# Altium schematic sheet Pg4 Switches, Latches, Connectors.SchDoc: Switches and Safety Latches
size Letter; Organization: Altium Limited; Address1: L3, 12a Rodborough Rd; Address2: Frenchs Forest; Address3: NSW; Address4: Australia 2086; SheetNumber: 4; SheetTotal: 4
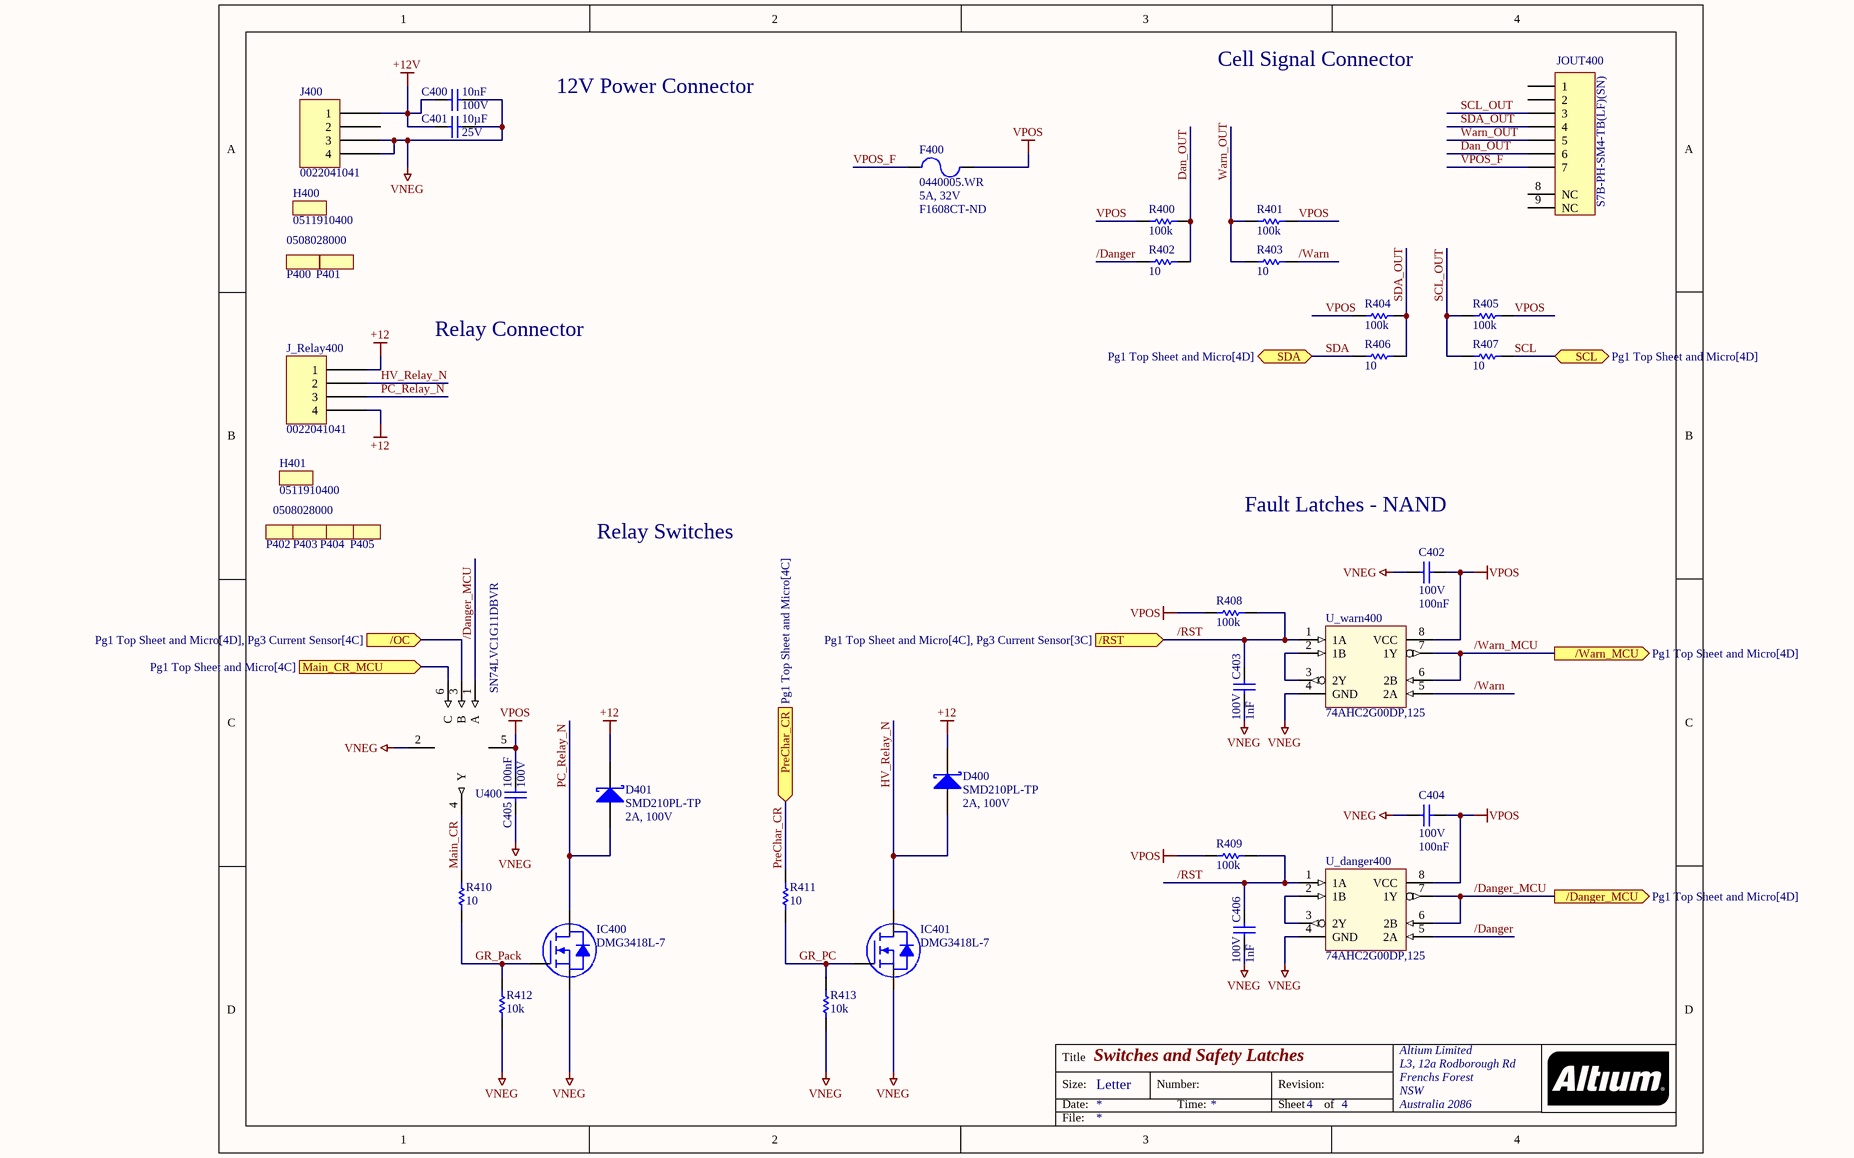
[diagram p0: Pg4 Switches, Latches, Connectors.SchDoc]

## Parts
C400  value 10nF  Rated: 100V  [CAPC2012N]  (hidden comment: C0805C103K1RAC7025)
C401  value 10µF  Rated: 25V  [CAPC3225N]  (hidden comment: C1210C106K3RACAUTO)
C402  value 100nF  Rated: 100V  [CAPC2012N]  (hidden comment: CL21B104KACNNNC)
C403  value 1nF  Rated: 100V  [CAPC2012N]  (hidden comment: C0805C102K1RACAUTO)
C404  value 100nF  Rated: 100V  [CAPC2012N]  (hidden comment: CL21B104KACNNNC)
C405  value 100nF  Rated: 100V  [CAPC2012N]  (hidden comment: CL21B104KACNNNC)
C406  value 1nF  Rated: 100V  [CAPC2012N]  (hidden comment: C0805C102K1RACAUTO)
D400  SMD210PL-TP  Rated: 2A, 100V  [SOD123]
D401  SMD210PL-TP  Rated: 2A, 100V  [SOD123]
F400  0440005.WR  Rated: 5A, 32V  Supplier Part Number 1: F1608CT-ND  [CAPC1608N]
H400  0511910400  (mechanical)
H401  0511910400  (mechanical)
IC400  DMG3418L-7  [DIODES SOT-23-3]
IC401  DMG3418L-7  [DIODES SOT-23-3]
J400  0022041041  [0022041041]
J_Relay400  0022041041  [0022041041]
JOUT400  S7B-PH-SM4-TB(LF)(SN)  [JST-PH-S7]
P400  0508028000  (value not drawn)  (mechanical)
P401  0508028000  (mechanical)
P402  0508028000  (value not drawn)  (mechanical)
P403  0508028000  (value not drawn)  (mechanical)
P404  0508028000  (value not drawn)  (mechanical)
P405  0508028000  (mechanical)
R400  value 100k  [RESC2012N]  (hidden comment: ERJ-6ENF1003V)
R401  value 100k  [RESC2012N]  (hidden comment: ERJ-6ENF1003V)
R402  value 10  [RESC2012N]  (hidden comment: ERJ-6ENF10R0V)
R403  value 10  [RESC2012N]  (hidden comment: ERJ-6ENF10R0V)
R404  value 100k  [RESC2012N]  (hidden comment: ERJ-6ENF1003V)
R405  value 100k  [RESC2012N]  (hidden comment: ERJ-6ENF1003V)
R406  value 10  [RESC2012N]  (hidden comment: ERJ-6ENF10R0V)
R407  value 10  [RESC2012N]  (hidden comment: ERJ-6ENF10R0V)
R408  value 100k  [RESC2012N]  (hidden comment: ERJ-6ENF1003V)
R409  value 100k  [RESC2012N]  (hidden comment: ERJ-6ENF1003V)
R410  value 10  [RESC2012N]  (hidden comment: ERJ-6ENF10R0V)
R411  value 10  [RESC2012N]  (hidden comment: ERJ-6ENF10R0V)
R412  value 10k  [RESC2012N]  (hidden comment: ERJ-6ENF1002V)
R413  value 10k  [RESC2012N]  (hidden comment: ERJ-6ENF1002V)
U400  SN74LVC1G11DBVR  [SOT23-6N]
U_danger400  74AHC2G00DP,125  [TSSOP-8]
U_warn400  74AHC2G00DP,125  [TSSOP-8]

## Ports
/Danger_MCU (out, see Pg1 Top Sheet and Micro[4D]), /OC (in, see Pg1 Top Sheet and Micro[4D], Pg3 Current Sensor[4C]), /RST (in, see Pg1 Top Sheet and Micro[4C], Pg3 Current Sensor[3C]), /Warn_MCU (out, see Pg1 Top Sheet and Micro[4D]), Main_CR_MCU (in, see Pg1 Top Sheet and Micro[4C]), PreChar_CR (in, see Pg1 Top Sheet and Micro[4C]), SCL (bidir, see Pg1 Top Sheet and Micro[4D]), SDA (bidir, see Pg1 Top Sheet and Micro[4D])

## Nets
+12: D400.2(K) D401.2(K) J_Relay400.1 J_Relay400.4
+12V: C400.1 C401.1 J400.1
VNEG: C400.2 C401.2 C402.2 C403.2 C404.2 C405.2 C406.2 IC400.2(S) IC401.2(S) J400.3 J400.4 R412.1 R413.1 U400.2(GND) U_danger400.4(GND) U_warn400.4(GND)
VPOS: C402.1 C404.1 C405.1 F400.2 R400.2 R401.1 R404.2 R405.1 R408.2 R409.2 U400.5(VCC) U_danger400.8(VCC) U_warn400.8(VCC)
/Danger: R402.1 U_danger400.5(2A)
/Danger_MCU: U400.1(A) U_danger400.6(2B) U_danger400.7(1Y) ; port /Danger_MCU
/OC: U400.3(B) ; port /OC
/RST: C403.1 C406.1 R408.1 R409.1 U_danger400.1(1A) U_warn400.1(1A) ; port /RST
/Warn: R403.2 U_warn400.5(2A)
/Warn_MCU: U_warn400.6(2B) U_warn400.7(1Y) ; port /Warn_MCU
Dan_OUT: JOUT400.6 R400.1 R402.2
GR_Pack: IC400.1(G) R410.1 R412.2
GR_PC: IC401.1(G) R411.1 R413.2
HV_Relay_N: D400.1(A) IC401.3(D) J_Relay400.2
Main_CR: R410.2 U400.4(Y)
Main_CR_MCU: U400.6(C) ; port Main_CR_MCU
PC_Relay_N: D401.1(A) IC400.3(D) J_Relay400.3
PreChar_CR: R411.2 ; port PreChar_CR
SCL: R407.2 ; port SCL
SCL_OUT: JOUT400.3 R405.2 R407.1
SDA: R406.1 ; port SDA
SDA_OUT: JOUT400.4 R404.1 R406.2
VPOS_F: F400.1 JOUT400.7
Warn_OUT: JOUT400.5 R401.2 R403.1
NetU_danger400_2: U_danger400.2(1B) U_danger400.3(2Y)
NetU_warn400_2: U_warn400.2(1B) U_warn400.3(2Y)

Not connected (* = marked no-connect by the designer): J400 2; JOUT400 1 2 8(NC) 9(NC)

## Notes on the sheet
- 12V Power Connector
- Cell Signal Connector
- Relay Connector
- Relay Switches
- Fault Latches - NAND
- Title
- Size:
- Date:
- Letter
- Number:
- Time:
- Revision:
- Sheet
- of
- File:

## Library data of the parts
C400 = C0805C103K1RAC7025: Capacitor, Ceramic, 10nF, 100V, 0805, 10%, 125C; Supplier 1: Digi-Key; Supplier Part Number 1: 399-C0805C103K1RAC7025CT-ND; Category: C; Tol: 10%; Temp: 125C
C401 = C1210C106K3RACAUTO: Capacitor, Ceramic, 10µF, 25V, 0805, 10%, 125C; Supplier 1: Digi-Key; Supplier Part Number 1: 399-7046-1-ND; Category: C; Tol: 10%; Temp: 125C
C402 C404 C405 = C0805C104K1RACAUTO: Capacitor, Ceramic, 100nF, 25V, 0805, 10%, 125C; Category: C; Tol: 10%; Temp: 125C; Supplier 1: Digi-Key; Supplier Part Number 1: 1276-1099-1-ND
C403 C406 = C0805C102K1RACAUTO: Capacitor, Ceramic, 1nF, 100V, 0805, 10%, 125C; Supplier 1: Digi-Key; Supplier Part Number 1: 399-6919-1-ND; Category: C; Tol: 10%; Temp: 125C
D400 D401 = SMD210PL: Diode, Si Sch, 100V, 2A, SOD123; Temp: 125C; Value: 850mV @ 2A; Category: D; Supplier 1: Digi-Key; Supplier Part Number 1: SMD210PL-TPMSCT-ND
F400 = 0440005.WR: Fuse, SMT, 5A, 32VAC/VDC, 1206; Value: 12mOhm; Temp: 150C; Category: F; Supplier 1: Digi-Key
H400 H401 = 0022041041(Housing): Housing, Molex, Maiting Part 0511910400; Value: 4 Pos; Category: J; Supplier 1: Digi-Key; Supplier Part Number 1: WM3350-ND
IC400 IC401 = DMG3418L-7: MOSFET N-CH 30V 4A SOT23; Manufacturer: Diodes Incorporated; Current - Continuous Drain (Id) @ 25°C: 4A (Ta); Drive Voltage (Max Rds On,  Min Rds On): 2.5V, 10V; FET Type: N-Channel; Gate Charge (Qg) (Max) @ Vgs: 5.5 nC @ 4.5 V; Input Capacitance (Ciss) (Max) @ Vds: 464.3 pF @ 15 V; Power Dissipation (Max): 1.4W (Ta); Rds On (Max) @ Id, Vgs: 60mOhm @ 4A, 10V; Vgs (Max): ±12V; Vgs(th) (Max) @ Id: 1.5V @ 250µA; Part Number: DMG3418L-7; ComponentLink1Description: Datasheet; ComponentLink1URL: https://www.diodes.com/assets/Datasheets/DMG3418L.pdf; ComponentLink2Description: DigiKey Link; ComponentLink2URL: https://www.digikey.com/en/products/detail/diodes-incorporated/DMG3418L-7/4810932; Drain to Source Voltage (Vdss): 30 V; LastUpdated: 2/2/2023 9:00:08 PM; Lifecycle Status: Active; Minimum Order: 1; Mounting Type: Surface Mount; Operating Temperature: -55°C ~ 150°C (TJ); Package / Case: TO-236-3, SC-59, SOT-23-3; Packaging: TapeAndReel; Part Status: Active; Price: 0.10; Series: -; Supplier 1: DigiKey; Supplier Part Number 1: DMG3418L-7DICT-ND; Supplier Device Package: SOT-23-3; Technology: MOSFET (Metal Oxide)
J400 J_Relay400 = 0022041041: Header, 4 pos, 2.5mm pitch, Molex / Kit Parts / Housing: 0511910400 / Terminals: 0508028000; Value: 4 Pos; Temp: 80C; Rated: N/A; Category: J; Tol: N/A; Supplier 1: Digi-Key; Supplier Part Number 1: WM18787-ND
JOUT400 = S7B-PH-SM4-TB(LF)(SN): Header, JST, 7-Pin, Right-Angle, PH, Surface Mount; Category: J; Supplier 1: Digi-Key; Supplier Part Number 1: 455-1754-1-ND
P400-P405 = 0022041041(Terminal): Terminal, Molex, Maiting Part 0511910400; Value: 4 Pos; Category: J; Supplier 1: Digi-Key; Supplier Part Number 1: WM3328CT-ND
R400 R401 R404 R405 R408 R409 = ERJ-6ENF1003V: Resistor, Fixed, 100 kOhm, 0805, 1%, 1/8W; Supplier 1: Digi-Key; Supplier Part Number 1: P100KCCT-ND; Rated: 1/8W; Tol: 1%; Category: R
R402 R403 R406 R407 R410 R411 = ERJ-6ENF10R0V: Resistor, Fixed, 10 Ohm, 0805, 1%, 1/8W; Supplier 1: Digi-Key; Supplier Part Number 1: P10.0CCT-ND; Rated: 1/8W; Tol: 1%; Category: R
R412 R413 = ERJ-6ENF1002V: Resistor, Fixed, 10 kOhm, 0805, 1%, 1/8W; Supplier 1: Digi-Key; Supplier Part Number 1: P10.0KCCT-ND; Rated: 1/8W; Tol: 1%; Category: R
U400 = 74LVC1G11: Logic, AND, Single, 3-In, SOT23-6; Rated: 1.65 ~ 5.5V; Category: U; Supplier 1: Digi-Key; Supplier Part Number 1: 296-16810-1-ND
U_danger400 U_warn400 = 74AHC2G00: Logic, NAND, Dual, Schmitt Trigger, TSSOP-8; Rated: 5.5V, 24mA; Category: U; Supplier 1: Digi-Key; Supplier Part Number 1: 1727-6521-1-ND